# EAGLE design XOR (EAGLE 7.4.0)
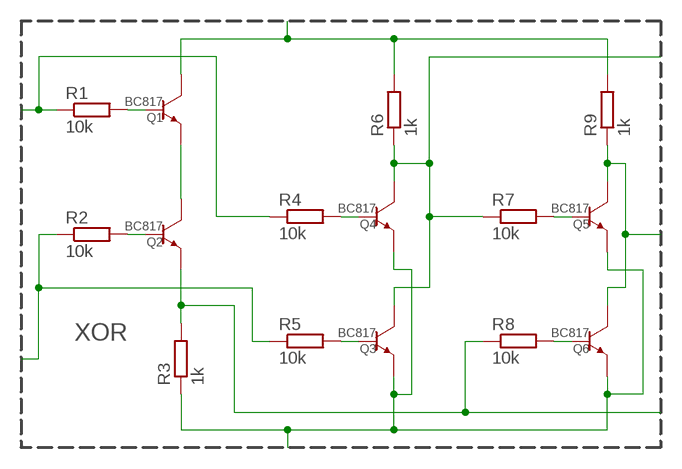
[diagram p0: schematic, sheet 1]

## Parts
Q1  BC817  TRANSISTOR-NPN-GENERICDEFAULT-SOT23-BEC  [SOT23]
Q2  BC817  TRANSISTOR-NPN-GENERICDEFAULT-SOT23-BEC  [SOT23]
Q3  BC817  TRANSISTOR-NPN-GENERICDEFAULT-SOT23-BEC  [SOT23]
Q4  BC817  TRANSISTOR-NPN-GENERICDEFAULT-SOT23-BEC  [SOT23]
Q5  BC817  TRANSISTOR-NPN-GENERICDEFAULT-SOT23-BEC  [SOT23]
Q6  BC817  TRANSISTOR-NPN-GENERICDEFAULT-SOT23-BEC  [SOT23]
R1  10k  R-EU_R0603  [R0603]
R2  10k  R-EU_R0603  [R0603]
R3  1k  R-EU_R0603  [R0603]
R4  10k  R-EU_R0603  [R0603]
R5  10k  R-EU_R0603  [R0603]
R6  1k  R-EU_R0603  [R0603]
R7  10k  R-EU_R0603  [R0603]
R8  10k  R-EU_R0603  [R0603]
R9  1k  R-EU_R0603  [R0603]

## Nets
_VN: Q3.P$2(EMITTER) Q4.P$2(EMITTER) Q5.P$2(EMITTER) Q6.P$2(EMITTER) R3.1
_VP: Q1.P$3(COLLECTOR) R6.2 R9.2
A: R1.1 R4.1
AND: Q2.P$2(EMITTER) R3.2 R8.1
B: R2.1 R5.1
N$19: Q1.P$2(EMITTER) Q2.P$3(COLLECTOR)
N$21: Q1.P$1(BASE) R1.2
N$22: Q2.P$1(BASE) R2.2
N$23: Q3.P$1(BASE) R5.2
N$24: Q4.P$1(BASE) R4.2
N$25: Q6.P$1(BASE) R8.2
N$26: Q5.P$1(BASE) R7.2
NOR: Q3.P$3(COLLECTOR) Q4.P$3(COLLECTOR) R6.1 R7.1
XOR: Q5.P$3(COLLECTOR) Q6.P$3(COLLECTOR) R9.1

## Notes on the sheet
- XOR

## Library data of the parts
Q1-Q6 = p.peter-gator:TRANSISTOR-NPN-GENERIC; SV_SPICE_MODEL: NPN (); SV_SPICE_ORDER: COLLECTOR;BASE;EMITTER; SV_SPICE_PREFIX: Q
R1-R9 = p.peter-gator:R-EU_: RESISTOR, European symbol; SV_SPICE_ORDER: 1;2; SV_SPICE_PREFIX: R

## Board
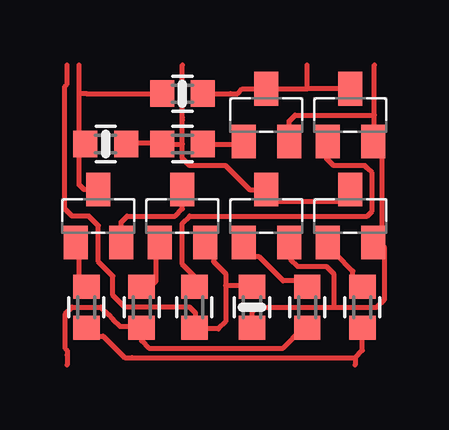
[diagram p1: board, top side]
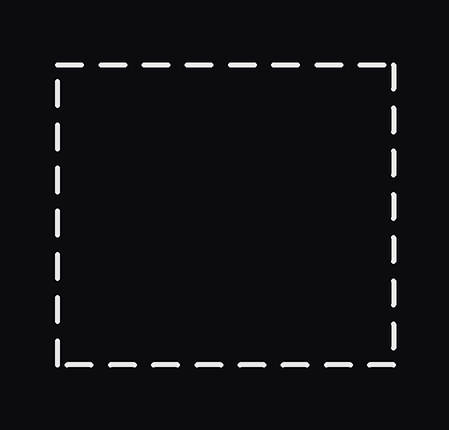
[diagram p2: board, bottom side, seen from below]

No outline drawn. Coordinates in mm, seen from the top.
Copper layers (1*16): Top 0.035mm / dielectric 1.5mm / Bottom 0.035mm
Design rules "Fusion_eagle_rule_v1.1 *": minimum track width 6mil, minimum drill 12mil, track to track 6mil, track to pad 6mil, pad to pad 6mil, via to via 6mil, smd to smd 0mil, copper to edge 10mil, drill to drill 10mil, minimum pad ring 15mil, minimum via ring 6mil, stop-mask expansion 2mil, vias tented up to drill 100mil, thermal gap 10mil

### Footprints (pad centres in the part's own frame; a part is rotated, then mirrored left to right if it is on the bottom)
SOT23 = smd 1 x 1.4: P$1 -0.95,-1.1; P$2 0.95,-1.1; P$3 0,1.1
R0603 = smd 1 x 1.1: 1 -0.85,0; 2 0.85,0

### Placement (x,y rotation side)
Q1  1.8,6.2 0 top
Q2  5.3,6.2 0 top
Q3  8.8,6.2 0 top
Q4  12.3,6.2 0 top
Q5  8.8,10.4 0 top
Q6  12.3,10.4 0 top
R1  1.3,2.4 90 top
R2  3.6,2.4 90 top
R3  8.2,2.4 90 top
R4  12.8,2.4 90 top
R5  10.5,2.4 90 top
R6  2.1,9.2 180 top
R7  5.3,9.2 0 top
R8  5.8,2.4 90 top
R9  5.3,11.3 180 top

### Tracks (layer width: path | path; a pad name or v marks a point on that pad's centre or on a via)
_VN
  Top 0.2: R3.1 8.2,2.2 8.4,2.4 11.6,2.4 | 11.6,2.4 13.4,2.4 13.7,2.7 13.7,4.9 13.6,5 13.6,5.1 13.55,5.05 13.2,5.05 Q4.P$2 | Q3.P$2 9.8,5.1 9.8,4.4 10.1,4.1 11.3,4.1 11.6,3.8 11.6,2.4 | Q4.P$2 13.25,5.15 13.3,5.2 | 13.3,9.15 13.55,9.15 13.6,9.1 13.6,5.45 Q4.P$2 | 13.3,10.4 13.3,12.5 | 13.3,10.4 13.3,9.5 13.2,9.35 Q6.P$2 | Q5.P$2 9.75,10.15 10,10.4 13.3,10.4
  Top 0.406: 13.3,9.15 13.25,9.15 Q6.P$2
_VP
  Top 0.2: Q1.P$3 1.2,7.3 1,7.5 1,9.25 | 1,9.2 0.9,9.2 1,9.2 | R9.2 1.3,11.3 1,11.3 | 1,9.2 1,9.25 | 1,9.25 1,11.3 | 1,11.3 1,12.5 | 1,9.25 R6.2 1,9.2
A
  Top 0.2: R1.1 1.75,1.55 1.75,1.25 1.7,1.2 2,1.2 2.9,0.3 3.2,0.3 12.5,0.3 | 12.5,0.3 12.8,0.6 R4.1 | 12.5,0.3 12.5,0
AND
  Top 0.2: Q2.P$2 6.2,5.05 6.55,5.05 6.6,5 6.6,4.3 7.1,3.8 7.1,3.3 | 6.3,5.15 Q2.P$2 | 8.15,3.2 R3.2 8.2,3.3 7.1,3.3 | 6.15,5 Q2.P$2 | 6,4.9 6.05,4.9 | 7.1,3.3 7.1,1.8 6.8,1.5 5.85,1.5 5.85,1.7 | 5.85,1.7 5.85,2.15 5.6,2.4 2.9,2.4 2.4,2.9 2.4,3.7 1.8,4.3 1.8,5.8 1.4,6.2 0.7,6.2 0.4,6.5 0.4,11.6 0.5,11.7 0.5,12.5 | R8.1 5.8,1.65 5.85,1.7
  Top 0.406: 6.05,4.9 6.25,4.9 Q2.P$2
B
  Top 0.2: R5.1 10.45,1.5 10.3,1.5 9.5,0.7 3.9,0.7 3.6,1 R2.1 3.55,1.6 2.7,1.6 2.4,1.9 2.2,2.1 1.9,2.4 0.7,2.4 0.4,2.1 0.4,0.7 0.5,0.6 0.5,0.4 0.5,0
N$19
  Top 0.2: Q1.P$2 2.75,5.95 3,6.2 5,6.2 5.3,6.5 Q2.P$3
N$21
  Top 0.2: R1.2 1.4,3.3 1.3,3.3 1,3.5 1,4.95 Q1.P$1
N$22
  Top 0.2: R2.2 3.95,3.25 4.2,3.5 4.2,4.95 Q2.P$1
N$23
  Top 0.2: 8.2,4.75 8.03,4.92 | 8.03,4.92 Q3.P$1 | 8.03,4.92 8,4.85 7.9,4.75 7.9,4.6 8.2,4.5 8.5,4.5 9.5,3.5 10.1,3.5 10.45,3.25 R5.2
N$24
  Top 0.2: 11.4,5.05 Q4.P$1 11.7,4.75 11.7,4.6 12.4,3.9 12.4,3.5 12.75,3.25 R4.2
N$25
  Top 0.2: R8.2 5.8,3.7 5.3,4.2 5.3,5.9 5.6,6.2 13,6.2 13.2,6.4 13.2,8 13,8.2 12.9,8.3 11.6,8.3 11.4,8.5 11.3,8.6 11.3,9.25 Q6.P$1
N$26
  Top 0.2: R7.2 7.75,9.2 Q5.P$1
NOR
  Top 0.2: Q4.P$3 12.3,6.8 8.9,6.8 8.8,6.9 Q3.P$3 8.1,7.3 8,7.4 7.6,7.8 7.1,8.3 5.6,8.3 5.3,8.6 5.3,9.2 | 5.3,9.2 5.3,10.2 | 5.3,10.2 5.3,10.3 5.3,12.5 | 5.3,9.2 5.3,10.2 | R6.1 2.7,9.25 4.4,9.25 R7.1 5.3,9.2
XOR
  Top 0.2: R9.1 7.3,11.3 7.6,11.3 7.8,11.5 Q5.P$3 10.5,11.5 | Q6.P$3 10.5,11.5 | 10.5,11.5 10.5,12.5